# Altium project fakeRAK11200.PrjPcb
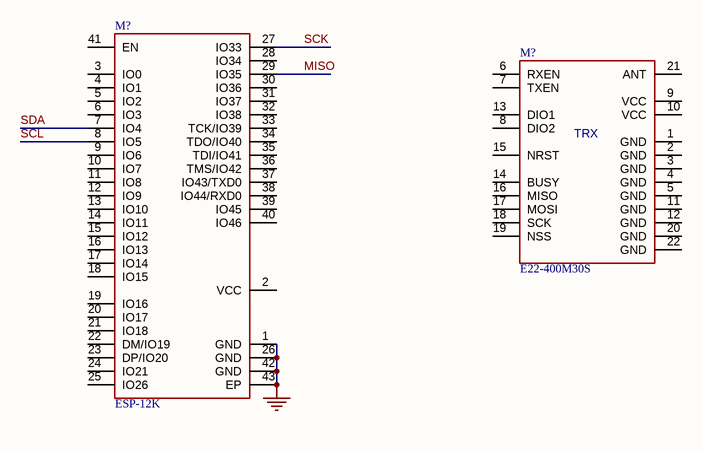
[diagram p0: fakeRAK11200.SchDoc]
1 sheet, 2 parts. Net scope: global (net labels, ports and power ports of the same name join across sheets).

## Sheet fakeRAK11200.SchDoc
size A4; SheetNumber: 1; SheetTotal: 1

### Parts
(Parts that share a designator on the sheet are numbered #1, #2 ... from top to bottom, then left to right.)
M?#1  E22-400M30S  [PE22(400M30S)]
M?#2  ESP-12K  [ESP-12K]

### Nets
GND: M?#2.1(GND) M?#2.26(GND) M?#2.42(GND) M?#2.43(EP)
MISO: M?#2.29(IO35)
SCK: M?#2.27(IO33)
SCL: M?#2.8(IO5)
SDA: M?#2.7(IO4)

Not connected (* = marked no-connect by the designer): M?#1 1(GND) 2(GND) 3(GND) 4(GND) 5(GND) 6(RXEN) 7(TXEN) 8(DIO2) 9(VCC) 10(VCC) 11(GND) 12(GND) 13(DIO1) 14(BUSY) 15(NRST) 16(MISO) 17(MOSI) 18(SCK) 19(NSS) 20(GND) 21(ANT) 22(GND); M?#2 2(VCC) 3(IO0) 4(IO1) 5(IO2) 6(IO3) 9(IO6) 10(IO7) 11(IO8) 12(IO9) 13(IO10) 14(IO11) 15(IO12) 16(IO13) 17(IO14) 18(IO15) 19(IO16) 20(IO17) 21(IO18) 22(DM/IO19) 23(DP/IO20) 24(IO21) 25(IO26) 28(IO34) 30(IO36) 31(IO37) 32(IO38) 33(TCK/IO39) 34(TDO/IO40) 35(TDI/IO41) 36(TMS/IO42) 37(IO43/TXD0) 38(IO44/RXD0) 39(IO45) 40(IO46) 41(EN)

### Notes on the sheet
- (in symbol E22) TRX

### Library data of the parts
M?#1 = E22